# Altium schematic sheet Medidor bateria.SchDoc
size A4
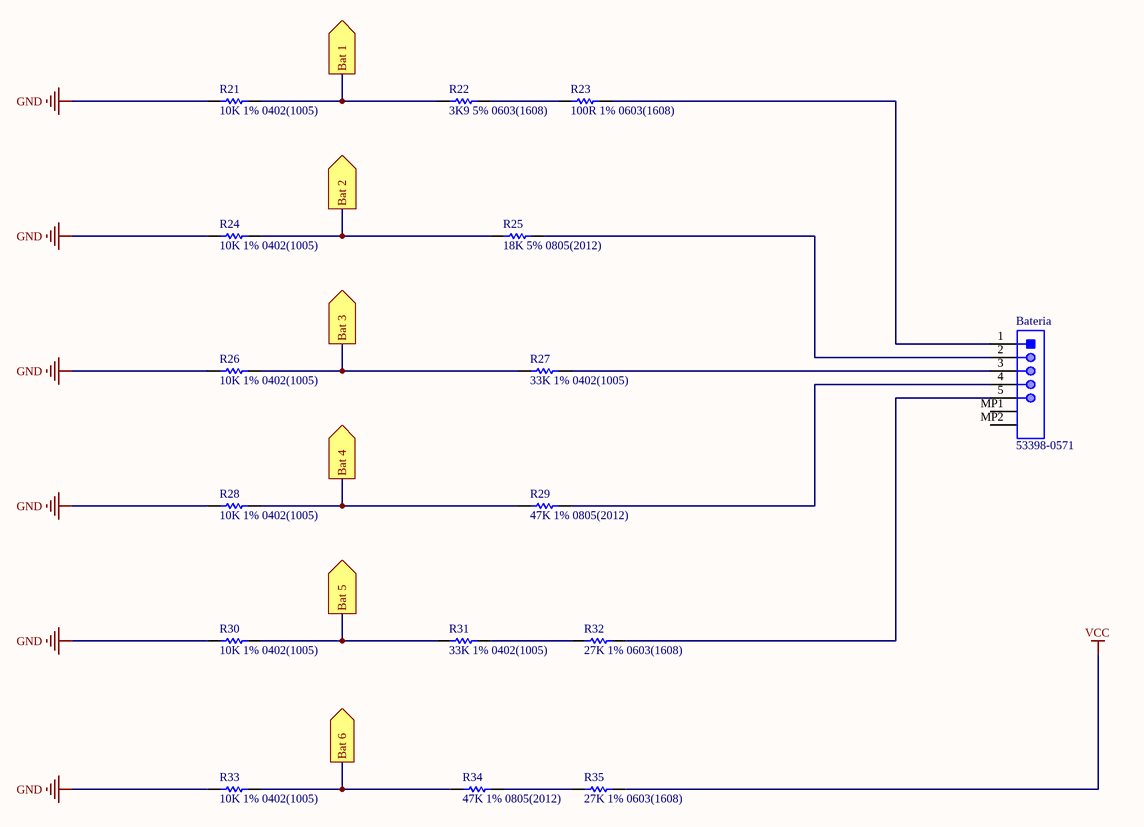
[diagram p0: Medidor bateria.SchDoc]

## Parts
Bateria  53398-0571  [MOLX-53398-0571-5_V]
R21  10K 1% 0402(1005)  [RESC0402(1005)_L]
R22  3K9 5% 0603(1608)  [RESC0603(1608)_L]
R23  100R 1% 0603(1608)  [RESC0603(1608)_L]
R24  10K 1% 0402(1005)  [RESC0402(1005)_L]
R25  18K 5% 0805(2012)  [RESC0805(2012)_N]
R26  10K 1% 0402(1005)  [RESC0402(1005)_L]
R27  33K 1% 0402(1005)  [RESC0402(1005)_L]
R28  10K 1% 0402(1005)  [RESC0402(1005)_L]
R29  47K 1% 0805(2012)  [RESC0805(2012)_N]
R30  10K 1% 0402(1005)  [RESC0402(1005)_L]
R31  33K 1% 0402(1005)  [RESC0402(1005)_L]
R32  27K 1% 0603(1608)  [RESC0603(1608)_L]
R33  10K 1% 0402(1005)  [RESC0402(1005)_L]
R34  47K 1% 0805(2012)  [RESC0805(2012)_N]
R35  27K 1% 0603(1608)  [RESC0603(1608)_L]

## Ports
Bat 1 (out), Bat 2 (out), Bat 3 (out), Bat 4 (out), Bat 5 (out), Bat 6 (out)

## Nets
GND: R21.1 R24.1 R26.1 R28.1 R30.1 R33.1
VCC: R35.2
Bat 1: R21.2 R22.1 ; port Bat 1
Bat 2: R24.2 R25.1 ; port Bat 2
Bat 3: R26.2 R27.1 ; port Bat 3
Bat 4: R28.2 R29.1 ; port Bat 4
Bat 5: R30.2 R31.1 ; port Bat 5
Bat 6: R33.2 R34.1 ; port Bat 6
NetBateria_1: Bateria.1 R23.2
NetBateria_2: Bateria.2 R25.2
NetBateria_3: Bateria.3 R27.2
NetBateria_4: Bateria.4 R29.2
NetBateria_5: Bateria.5 R32.2
NetR22_2: R22.2 R23.1
NetR31_2: R31.2 R32.1
NetR34_2: R34.2 R35.1

Not connected (* = marked no-connect by the designer): Bateria MP1 MP2

## Library data of the parts
Bateria = CMP-2000-05250-1: Male Header, Pitch 1.25 mm, 1 x 5 Postion, Height 4.7 mm, -40 to 85 degC, RoHS, Tape and Reel; Brand: Molex; Number of Positions: 5Position; Mounting Angle: Vertical; Current Rating: 1A; Pitch: 1.25mm; Voltage Rating: 125V; Type: Shrouded; Tradename: PicoBlade; Datasheet Version: Rev. E, 04/2006; Housing Material: Nylon; Datasheet URL: http://www.molex.com/pdm_docs/sd/533980571_sd.pdf; Termination Style: SMD; Contact Gender: Pin(Male); Factory Pack Quantity: 1000; Number of Rows: 1Row; Product: Headers; Package Reference: MOLX-53398-0571-5; Contact Material: PhosphorBronze; RoHS: Details; Manufacturer URL: http://www.molex.com/; Product Category: Headers&WireHousings; Contact Plating: Tin; Manufacturer: Molex; Series: 53398; Packaging: Reel; Mounting Style: SMD
R21 = CMP-1011-00623-1: 10K 0.063W 1% 0402 (1005 Metric)  SMD                               71-CRCW040210K0FKEDC; Case-Metric: 1005; Value: 10000.00 Ohm; Case-EIA: 0402; Tolerance: 1 %; Technology: SMT; Power: 0.063 W
R22 = CMP-1012-00088-1: 3K9 0.1W 5% 0603 (1608 Metric)  SMD                                 755-ESR03EZPJ392; Case-EIA: 0603; Power: 0.25 W; Value: 3900.00 Ohm; Case-Metric: 1608; Technology: SMT; Tolerance: 5 %
R23 = CMP-1012-00397-1: 100R 0.1W 1% 0603 (1608 Metric)  SMD                               71-CRCW0603100RFKEAC; Value: 100.00 Ohm; Case-EIA: 0603; Case-Metric: 1608; Technology: SMT; Tolerance: 1 %; Power: 0.1 W
R24 = CMP-1011-00623-1: 10K 0.063W 1% 0402 (1005 Metric)  SMD                                  71-CRCW040210K0FKEDC; Case-Metric: 1005; Value: 10000.00 Ohm; Case-EIA: 0402; Tolerance: 1 %; Technology: SMT; Power: 0.063 W
R25 = CMP-1013-00104-1: 18K 0.125W 5% 0805 (2012 Metric)  SMD                                  667-ERJ-6GEYJ183V; Value: 18000.00 Ohm; Case-EIA: 0805; Case-Metric: 2012; Technology: SMT; Power: 0.125 W; Tolerance: 5 %
R26 = CMP-1011-00623-1: 10K 0.063W 1% 0402 (1005 Metric)  SMD                                 71-CRCW040210K0FKEDC; Case-Metric: 1005; Value: 10000.00 Ohm; Case-EIA: 0402; Tolerance: 1 %; Technology: SMT; Power: 0.063 W
R27 R31 = CMP-1011-00680-1: 33K 0.063W 1% 0402 (1005 Metric)  SMD                                 755-SFR01MZPF3302; Value: 33000.00 Ohm; Case-EIA: 0402; Case-Metric: 1005; Power: 0.063 W; Tolerance: 1 %; Technology: SMT
R28 R33 = CMP-1011-00623-1: 10K 0.063W 1% 0402 (1005 Metric)  SMD                                   71-CRCW040210K0FKEDC; Case-Metric: 1005; Value: 10000.00 Ohm; Case-EIA: 0402; Tolerance: 1 %; Technology: SMT; Power: 0.063 W
R29 = CMP-1013-00699-1: 47K 0.125W 1% 0805 (2012 Metric)  SMD                                66-PCFW0805LF034702B; Case-Metric: 2012; Value: 47000.00 Ohm; Power: 0.100 W; Case-EIA: 0805; Tolerance: 1 %; Technology: SMT
R30 = CMP-1011-00623-1: 10K 0.063W 1% 0402 (1005 Metric)  SMD                                         71-CRCW040210K0FKEDC; Case-Metric: 1005; Value: 10000.00 Ohm; Case-EIA: 0402; Tolerance: 1 %; Technology: SMT; Power: 0.063 W
R32 = CMP-1012-00670-1: 27K 0.1W 1% 0603 (1608 Metric)  SMD                                      755-ESR03EZPF2702; Case-EIA: 0603; Case-Metric: 1608; Power: 0.250 W; Value: 27000.00 Ohm; Technology: SMT; Tolerance: 1 %
R34 = CMP-1013-00699-1: 47K 0.125W 1% 0805 (2012 Metric)  SMD                               66-PCFW0805LF034702B; Case-Metric: 2012; Value: 47000.00 Ohm; Power: 0.100 W; Case-EIA: 0805; Tolerance: 1 %; Technology: SMT
R35 = CMP-1012-00670-1: 27K 0.1W 1% 0603 (1608 Metric)  SMD                                          755-ESR03EZPF2702; Case-EIA: 0603; Case-Metric: 1608; Power: 0.250 W; Value: 27000.00 Ohm; Technology: SMT; Tolerance: 1 %